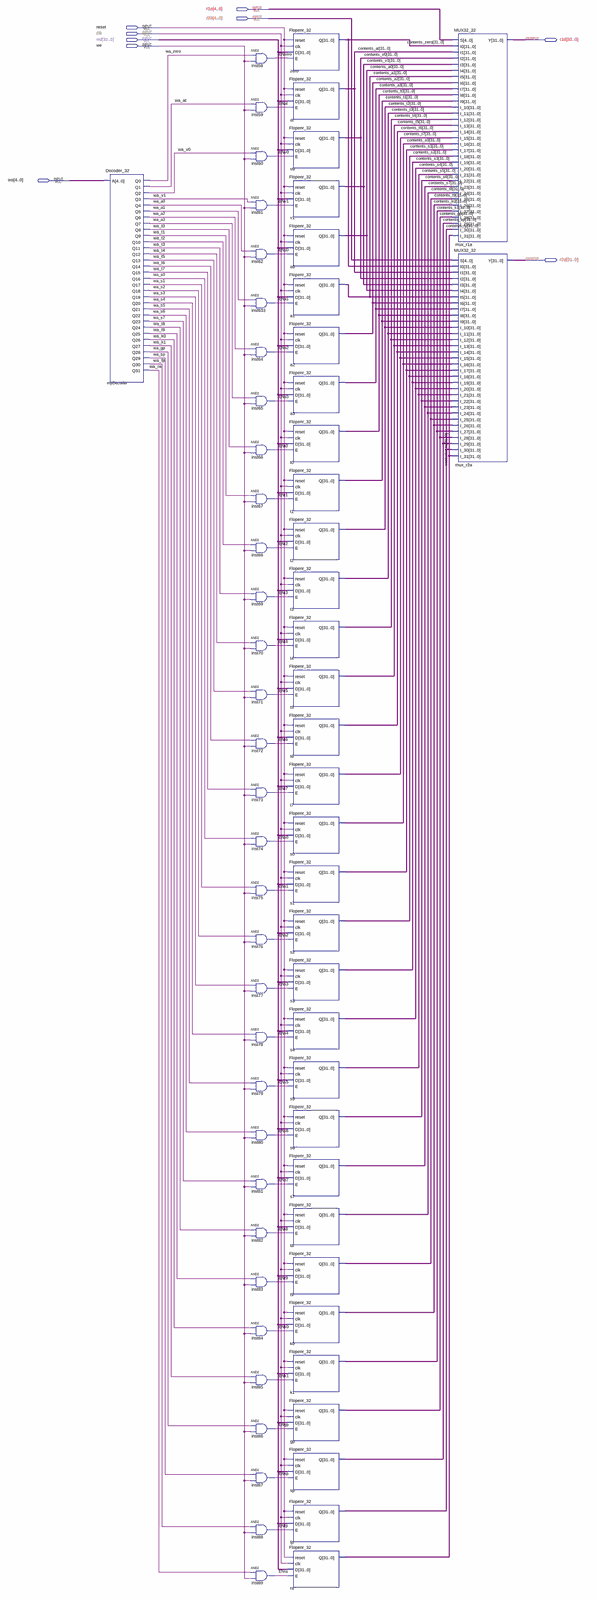
[diagram p0: schematic sheet, whole]
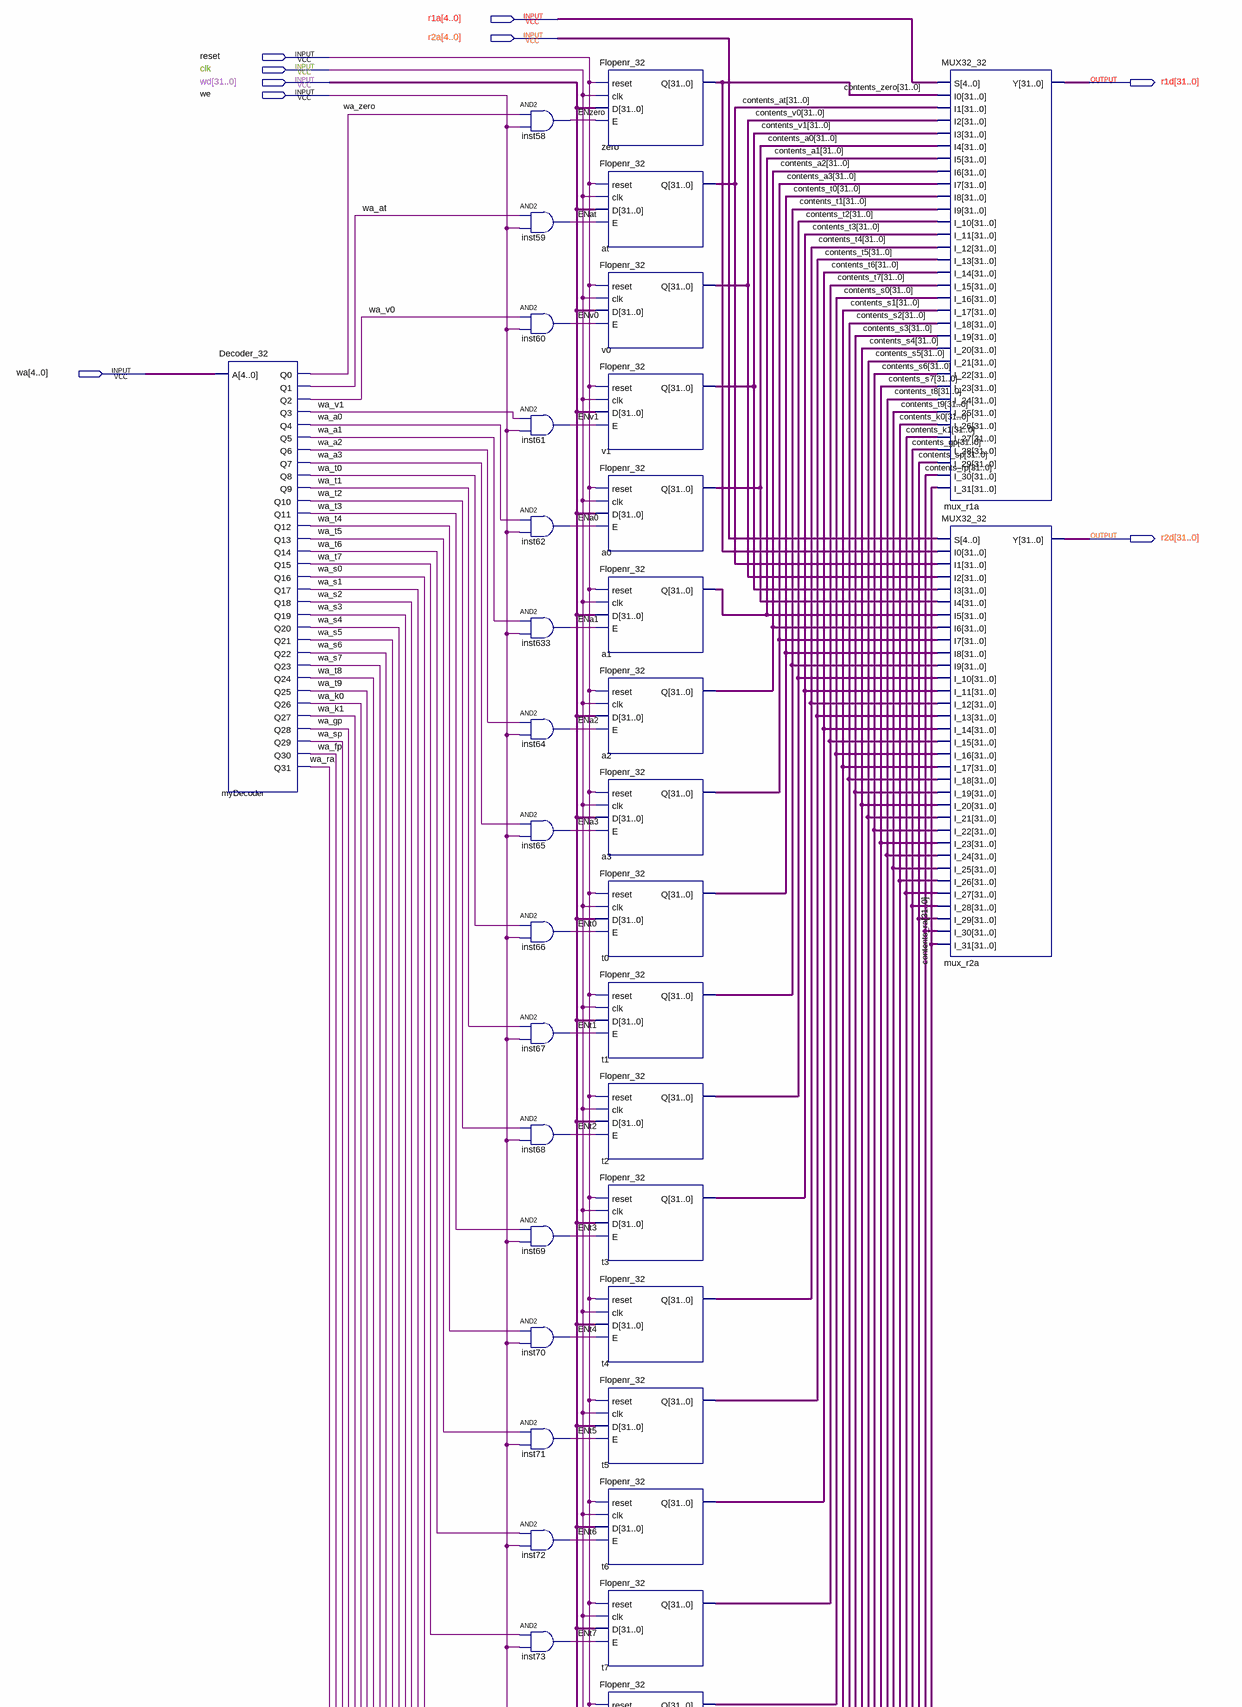
[diagram p1: schematic sheet, upper part]
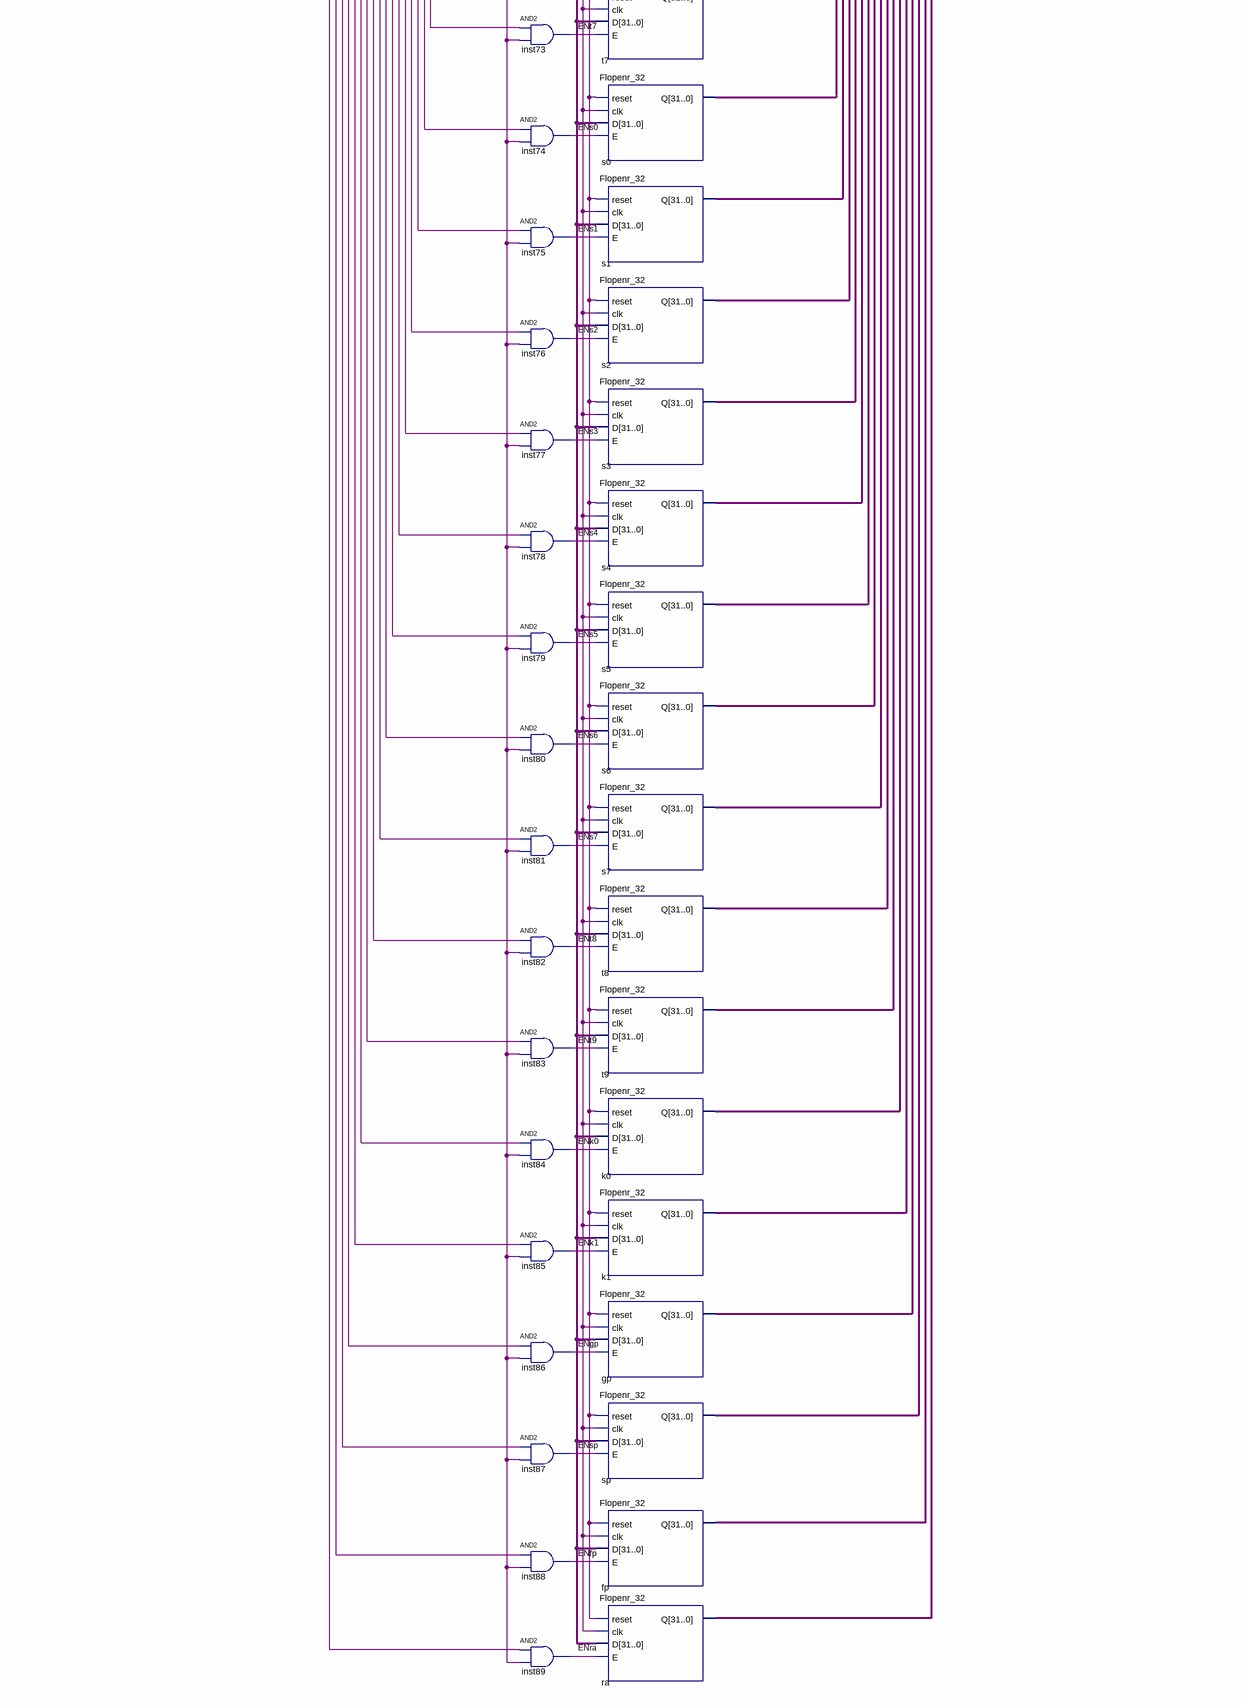
[diagram p2: schematic sheet, lower part]
// Quartus schematic RF.bdf as structural Verilog: 67 symbols, 9 pins
module RF (
  input  [4:0] r1a,
  input  [4:0] r2a,
  input  reset,
  input  clk,
  input  [31:0] wd,
  input  we,
  input  [4:0] wa,
  output [31:0] r1d,
  output [31:0] r2d
);

  wire ENa0, ENa1, ENa2, ENa3, ENat, ENfp, ENgp, ENk0, ENk1, ENra, ENs0, ENs1, ENs2, ENs3, ENs4, ENs5, ENs6,
       ENs7, ENsp, ENt0, ENt1, ENt2, ENt3, ENt4, ENt5, ENt6, ENt7, ENt8, ENt9, ENv0, ENv1, ENzero, wa_a0,
       wa_a1, wa_a2, wa_a3, wa_at, wa_fp, wa_gp, wa_k0, wa_k1, wa_ra, wa_s0, wa_s1, wa_s2, wa_s3, wa_s4,
       wa_s5, wa_s6, wa_s7, wa_sp, wa_t0, wa_t1, wa_t2, wa_t3, wa_t4, wa_t5, wa_t6, wa_t7, wa_t8, wa_t9,
       wa_v0, wa_v1, wa_zero;
  wire [31:0] contents_a0, contents_a1, contents_a2, contents_a3, contents_at, contents_fp, contents_gp,
       contents_k0, contents_k1, contents_ra, contents_s0, contents_s1, contents_s2, contents_s3,
       contents_s4, contents_s5, contents_s6, contents_s7, contents_sp, contents_t0, contents_t1,
       contents_t2, contents_t3, contents_t4, contents_t5, contents_t6, contents_t7, contents_t8,
       contents_t9, contents_v0, contents_v1, contents_zero;

  Decoder_32 myDecoder (
    .A(wa), .Q0(wa_zero), .Q1(wa_at), .Q2(wa_v0), .Q3(wa_v1), .Q4(wa_a0), .Q5(wa_a1), .Q6(wa_a2), .Q7(wa_a3),
    .Q8(wa_t0), .Q9(wa_t1), .Q10(wa_t2), .Q11(wa_t3), .Q12(wa_t4), .Q13(wa_t5), .Q14(wa_t6), .Q15(wa_t7),
    .Q16(wa_s0), .Q17(wa_s1), .Q18(wa_s2), .Q19(wa_s3), .Q20(wa_s4), .Q21(wa_s5), .Q22(wa_s6), .Q23(wa_s7),
    .Q24(wa_t8), .Q25(wa_t9), .Q26(wa_k0), .Q27(wa_k1), .Q28(wa_gp), .Q29(wa_sp), .Q30(wa_fp), .Q31(wa_ra));
  and inst58 (ENzero, wa_zero, we);
  and inst59 (ENat, wa_at, we);
  and inst60 (ENv0, wa_v0, we);
  and inst61 (ENv1, wa_v1, we);
  and inst62 (ENa0, wa_a0, we);
  and inst633 (ENa1, wa_a1, we);
  and inst64 (ENa2, wa_a2, we);
  and inst65 (ENa3, wa_a3, we);
  and inst66 (ENt0, wa_t0, we);
  and inst67 (ENt1, wa_t1, we);
  and inst68 (ENt2, wa_t2, we);
  and inst69 (ENt3, wa_t3, we);
  and inst70 (ENt4, wa_t4, we);
  and inst71 (ENt5, wa_t5, we);
  and inst72 (ENt6, wa_t6, we);
  and inst73 (ENt7, wa_t7, we);
  and inst74 (ENs0, wa_s0, we);
  and inst75 (ENs1, wa_s1, we);
  and inst76 (ENs2, wa_s2, we);
  and inst77 (ENs3, wa_s3, we);
  and inst78 (ENs4, wa_s4, we);
  and inst79 (ENs5, wa_s5, we);
  and inst80 (ENs6, wa_s6, we);
  and inst81 (ENs7, wa_s7, we);
  and inst82 (ENt8, wa_t8, we);
  and inst83 (ENt9, wa_t9, we);
  and inst84 (ENk0, wa_k0, we);
  and inst85 (ENk1, wa_k1, we);
  and inst86 (ENgp, wa_gp, we);
  and inst87 (ENsp, wa_sp, we);
  and inst88 (ENfp, wa_fp, we);
  and inst89 (ENra, wa_ra, we);
  Flopenr_32 zero (.reset(reset), .clk(clk), .D(wd), .E(ENzero), .Q(contents_zero));
  Flopenr_32 at (.reset(reset), .clk(clk), .D(wd), .E(ENat), .Q(contents_at));
  Flopenr_32 v0 (.reset(reset), .clk(clk), .D(wd), .E(ENv0), .Q(contents_v0));
  Flopenr_32 v1 (.reset(reset), .clk(clk), .D(wd), .E(ENv1), .Q(contents_v1));
  Flopenr_32 a0 (.reset(reset), .clk(clk), .D(wd), .E(ENa0), .Q(contents_a0));
  Flopenr_32 a1 (.reset(reset), .clk(clk), .D(wd), .E(ENa1), .Q(contents_a1));
  Flopenr_32 a2 (.reset(reset), .clk(clk), .D(wd), .E(ENa2), .Q(contents_a2));
  Flopenr_32 a3 (.reset(reset), .clk(clk), .D(wd), .E(ENa3), .Q(contents_a3));
  Flopenr_32 t0 (.reset(reset), .clk(clk), .D(wd), .E(ENt0), .Q(contents_t0));
  Flopenr_32 t1 (.reset(reset), .clk(clk), .D(wd), .E(ENt1), .Q(contents_t1));
  Flopenr_32 t2 (.reset(reset), .clk(clk), .D(wd), .E(ENt2), .Q(contents_t2));
  Flopenr_32 t3 (.reset(reset), .clk(clk), .D(wd), .E(ENt3), .Q(contents_t3));
  Flopenr_32 t4 (.reset(reset), .clk(clk), .D(wd), .E(ENt4), .Q(contents_t4));
  Flopenr_32 t5 (.reset(reset), .clk(clk), .D(wd), .E(ENt5), .Q(contents_t5));
  Flopenr_32 t6 (.reset(reset), .clk(clk), .D(wd), .E(ENt6), .Q(contents_t6));
  Flopenr_32 t7 (.reset(reset), .clk(clk), .D(wd), .E(ENt7), .Q(contents_t7));
  Flopenr_32 s0 (.reset(reset), .clk(clk), .D(wd), .E(ENs0), .Q(contents_s0));
  Flopenr_32 s1 (.reset(reset), .clk(clk), .D(wd), .E(ENs1), .Q(contents_s1));
  Flopenr_32 s2 (.reset(reset), .clk(clk), .D(wd), .E(ENs2), .Q(contents_s2));
  Flopenr_32 s3 (.reset(reset), .clk(clk), .D(wd), .E(ENs3), .Q(contents_s3));
  Flopenr_32 s4 (.reset(reset), .clk(clk), .D(wd), .E(ENs4), .Q(contents_s4));
  Flopenr_32 s5 (.reset(reset), .clk(clk), .D(wd), .E(ENs5), .Q(contents_s5));
  Flopenr_32 s6 (.reset(reset), .clk(clk), .D(wd), .E(ENs6), .Q(contents_s6));
  Flopenr_32 s7 (.reset(reset), .clk(clk), .D(wd), .E(ENs7), .Q(contents_s7));
  Flopenr_32 t8 (.reset(reset), .clk(clk), .D(wd), .E(ENt8), .Q(contents_t8));
  Flopenr_32 t9 (.reset(reset), .clk(clk), .D(wd), .E(ENt9), .Q(contents_t9));
  Flopenr_32 k0 (.reset(reset), .clk(clk), .D(wd), .E(ENk0), .Q(contents_k0));
  Flopenr_32 k1 (.reset(reset), .clk(clk), .D(wd), .E(ENk1), .Q(contents_k1));
  Flopenr_32 gp (.reset(reset), .clk(clk), .D(wd), .E(ENgp), .Q(contents_gp));
  Flopenr_32 sp (.reset(reset), .clk(clk), .D(wd), .E(ENsp), .Q(contents_sp));
  Flopenr_32 fp (.reset(reset), .clk(clk), .D(wd), .E(ENfp), .Q(contents_fp));
  Flopenr_32 ra (.reset(reset), .clk(clk), .D(wd), .E(ENra), .Q(contents_ra));
  MUX32_32 mux_r1a (
    .S(r1a), .I0(contents_zero), .I1(contents_at), .I2(contents_v0), .I3(contents_v1), .I4(contents_a0),
    .I5(contents_a1), .I6(contents_a2), .I7(contents_a3), .I8(contents_t0), .I9(contents_t1),
    .I_10(contents_t2), .I_11(contents_t3), .I_12(contents_t4), .I_13(contents_t5), .I_14(contents_t6),
    .I_15(contents_t7), .I_16(contents_s0), .I_17(contents_s1), .I_18(contents_s2), .I_19(contents_s3),
    .I_20(contents_s4), .I_21(contents_s5), .I_22(contents_s6), .I_23(contents_s7), .I_24(contents_t8),
    .I_25(contents_t9), .I_26(contents_k0), .I_27(contents_k1), .I_28(contents_gp), .I_29(contents_sp),
    .I_30(contents_fp), .I_31(contents_ra), .Y(r1d));
  MUX32_32 mux_r2a (
    .S(r2a), .I0(contents_zero), .I1(contents_at), .I2(contents_v0), .I3(contents_v1), .I4(contents_a0),
    .I5(contents_a1), .I6(contents_a2), .I7(contents_a3), .I8(contents_t0), .I9(contents_t1),
    .I_10(contents_t2), .I_11(contents_t3), .I_12(contents_t4), .I_13(contents_t5), .I_14(contents_t6),
    .I_15(contents_t7), .I_16(contents_s0), .I_17(contents_s1), .I_18(contents_s2), .I_19(contents_s3),
    .I_20(contents_s4), .I_21(contents_s5), .I_22(contents_s6), .I_23(contents_s7), .I_24(contents_t8),
    .I_25(contents_t9), .I_26(contents_k0), .I_27(contents_k1), .I_28(contents_gp), .I_29(contents_sp),
    .I_30(contents_fp), .I_31(contents_ra), .Y(r2d));
endmodule
